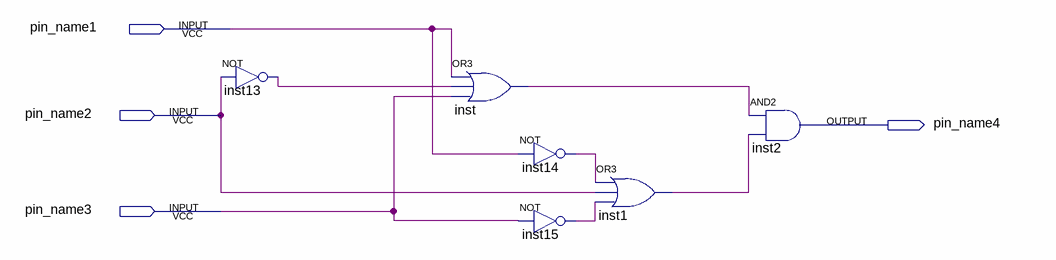
[diagram p0: schematic sheet]
// Quartus schematic lab3step0.bdf as structural Verilog: 6 symbols, 4 pins
module lab3step0 (
  input  pin_name1,
  input  pin_name2,
  input  pin_name3,
  output pin_name4
);

  wire inst1_out, inst13_out, inst14_out, inst15_out, inst_out;

  not inst13 (inst13_out, pin_name2);
  or inst (inst_out, pin_name1, inst13_out, pin_name3);
  not inst14 (inst14_out, pin_name1);
  not inst15 (inst15_out, pin_name3);
  or inst1 (inst1_out, inst14_out, pin_name2, inst15_out);
  and inst2 (pin_name4, inst_out, inst1_out);
endmodule
